# Altium project MPU9250-工程.PrjPcb
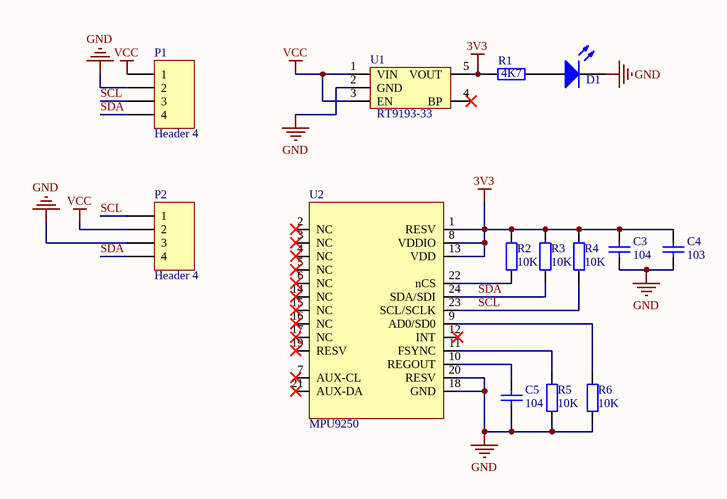
[diagram p0: MPU9250-原理图.SchDoc]
1 sheet, 14 parts. Net scope: global (net labels, ports and power ports of the same name join across sheets).
Board file: MPU9250-PCB.PcbDoc

## Sheet MPU9250-原理图.SchDoc
size A4

### Parts
C3  104  [1__0402-CAP(有丝印)]
C4  103  [1__0402-CAP(有丝印)]
C5  104  [1__0402-CAP(有丝印)]
D1  LED  [1__0603-LED_]  (value not drawn)
P1  Header 4  [1__排针_贴片单_4P两侧]
P2  Header 4  [1__FPC 4P (临时用)]
R1  4K7  [1__0402-RES(有丝印)]
R2  10K  [1__0402-RES(有丝印)]
R3  10K  [1__0402-RES(有丝印)]
R4  10K  [1__0402-RES(有丝印)]
R5  10K  [1__0402-RES(有丝印)]
R6  10K  [1__0402-RES(有丝印)]
U1  RT9193-33  [1__SOT23-5]
U2  MPU9250  [1__QFN3*3 (改)]

### Nets
3V3: C3.2 C4.2 R1.1 R2.2 R3.2 R4.2 U1.5(VOUT) U2.1(RESV) U2.8(VDDIO) U2.13(VDD)
GND: C3.1 C4.1 C5.1 D1.2 P1.2 P2.3 R5.1 R6.1 U1.2(GND) U2.18(GND) U2.20(RESV)
VCC: P1.1 P2.2 U1.1(VIN) U1.3(EN)
SCL: P1.3 P2.1 R4.1 U2.23(SCL/SCLK)
SDA: P1.4 P2.4 R3.1 U2.24(SDA/SDI)
NetC5_2: C5.2 U2.10(REGOUT)
NetD1_1: D1.1 R1.2
NetR2_1: R2.1 U2.22(nCS)
NetR5_2: R5.2 U2.11(FSYNC)
NetR6_2: R6.2 U2.9(AD0/SD0)

Not connected (* = marked no-connect by the designer): U1 4(BP)*; U2 2(NC)* 3(NC)* 4(NC)* 5(NC)* 6(NC)* 7(AUX-CL)* 12(INT)* 14(NC)* 15(NC)* 16(NC)* 17(NC)* 19(RESV)* 21(AUX-DA)*

### Library data of the parts
C3-C5 = Cap: Capacitor
  C3 C5: Value: 104
  C4: Value: 103
D1 = LED0: Typical INFRARED GaAs LED
P1 P2 = Header 4: Header, 4-Pin; LatestRevisionDate: 17-Jul-2002; LatestRevisionNote: Re-released for DXP Platform.; Publisher: Altium Limited; Price(RMB): 0.00
R1-R6 = Res2: Resistor
  R1: Value: 4K7
  R2-R6: Value: 10K
U1 = RT9193-33: 3.3V超低压差LDO